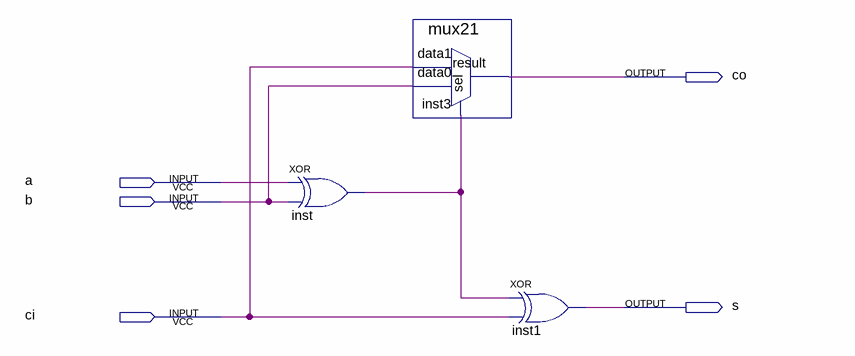
[diagram p0: schematic sheet]
// Quartus schematic FA.bdf as structural Verilog: 3 symbols, 5 pins
module FA (
  input  a,
  input  b,
  input  ci,
  output co,
  output s
);

  wire inst_out;

  xor inst (inst_out, a, b);
  mux21 inst3 (.data1(ci), .data0(b), .sel(inst_out), .result(co));
  xor inst1 (s, inst_out, ci);
endmodule
